# Altium schematic sheet 10 - GMAC0.SchDoc
size B; CompanyName: Microchip Technology Inc.; Organization: Microchip Technology; Address1: 2355 West Chandler Blvd.; Address2: Chandler, AZ  85224; Address4: USA; DocumentNumber: 10; SheetNumber: 10; SheetTotal: 15; SheetTitle: RGMII LAN8840
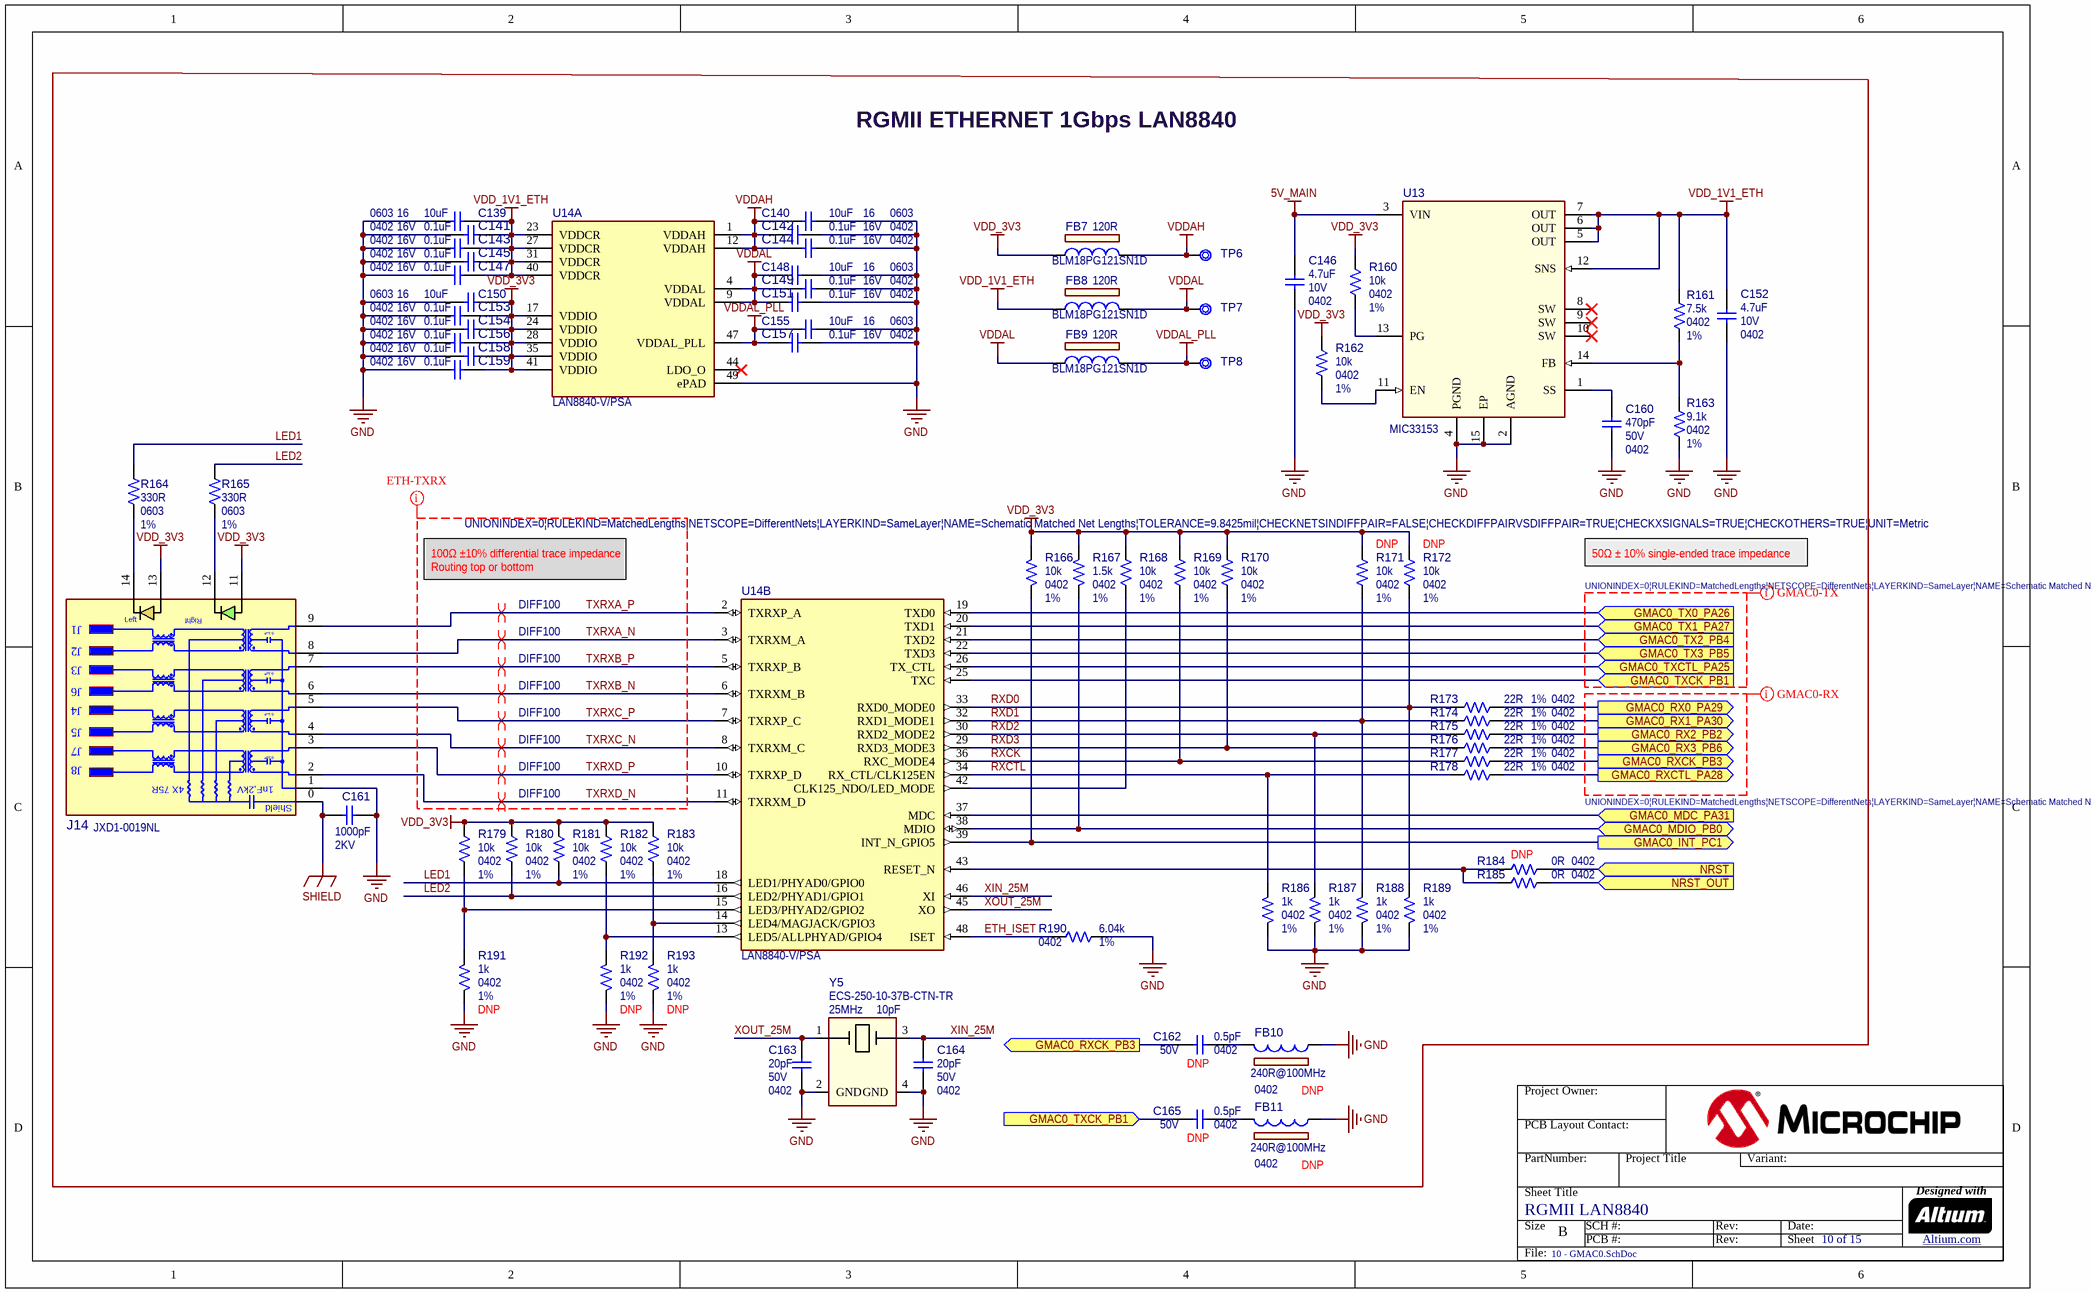
[diagram p0: 10 - GMAC0.SchDoc]

## Parts
C139  value 10uF  Voltage: 16  Package: 0603  [CAP_C_0603]  (hidden comment: Capacitor NP)
C140  value 10uF  Voltage: 16  Package: 0603  [CAP_C_0603]  (hidden comment: Capacitor NP)
C141  value 0.1uF  Voltage: 16V  Package: 0402  [CAP_C_0402]  (hidden comment: Capacitor NP)
C142  value 0.1uF  Voltage: 16V  Package: 0402  [CAP_C_0402]  (hidden comment: Capacitor NP)
C143  value 0.1uF  Voltage: 16V  Package: 0402  [CAP_C_0402]  (hidden comment: Capacitor NP)
C144  value 0.1uF  Voltage: 16V  Package: 0402  [CAP_C_0402]  (hidden comment: Capacitor NP)
C145  value 0.1uF  Voltage: 16V  Package: 0402  [CAP_C_0402]  (hidden comment: Capacitor NP)
C146  value 4.7uF  Voltage: 10V  Package: 0402  [CAP_C_0402]  (hidden comment: Capacitor NP)
C147  value 0.1uF  Voltage: 16V  Package: 0402  [CAP_C_0402]  (hidden comment: Capacitor NP)
C148  value 10uF  Voltage: 16  Package: 0603  [CAP_C_0603]  (hidden comment: Capacitor NP)
C149  value 0.1uF  Voltage: 16V  Package: 0402  [CAP_C_0402]  (hidden comment: Capacitor NP)
C150  value 10uF  Voltage: 16  Package: 0603  [CAP_C_0603]  (hidden comment: Capacitor NP)
C151  value 0.1uF  Voltage: 16V  Package: 0402  [CAP_C_0402]  (hidden comment: Capacitor NP)
C152  value 4.7uF  Voltage: 10V  Package: 0402  [CAP_C_0402]  (hidden comment: Capacitor NP)
C153  value 0.1uF  Voltage: 16V  Package: 0402  [CAP_C_0402]  (hidden comment: Capacitor NP)
C154  value 0.1uF  Voltage: 16V  Package: 0402  [CAP_C_0402]  (hidden comment: Capacitor NP)
C155  value 10uF  Voltage: 16  Package: 0603  [CAP_C_0603]  (hidden comment: Capacitor NP)
C156  value 0.1uF  Voltage: 16V  Package: 0402  [CAP_C_0402]  (hidden comment: Capacitor NP)
C157  value 0.1uF  Voltage: 16V  Package: 0402  [CAP_C_0402]  (hidden comment: Capacitor NP)
C158  value 0.1uF  Voltage: 16V  Package: 0402  [CAP_C_0402]  (hidden comment: Capacitor NP)
C159  value 0.1uF  Voltage: 16V  Package: 0402  [CAP_C_0402]  (hidden comment: Capacitor NP)
C160  value 470pF  Voltage: 50V  Package: 0402  [CAP_C_0402]  (hidden comment: Capacitor NP)
C161  value 1000pF  Voltage: 2KV  [CAP_C_1206]  (hidden comment: Capacitor NP)
C162  value 0.5pF  Voltage: 50V  Package: 0402  Populated: DNP  [CAP_C_0402]  (hidden comment: Capacitor NP)
C163  value 20pF  Voltage: 50V  Package: 0402  [CAP_C_0402]  (hidden comment: Capacitor NP)
C164  value 20pF  Voltage: 50V  Package: 0402  [CAP_C_0402]  (hidden comment: Capacitor NP)
C165  value 0.5pF  Voltage: 50V  Package: 0402  Populated: DNP  [CAP_C_0402]  (hidden comment: Capacitor NP)
FB7  value 120R  Manufacturer Part Number 1: BLM18PG121SN1D  [IND_C_0603]  (hidden comment: Ferrite Bead)
FB8  value 120R  Manufacturer Part Number 1: BLM18PG121SN1D  [IND_C_0603]  (hidden comment: Ferrite Bead)
FB9  value 120R  Manufacturer Part Number 1: BLM18PG121SN1D  [IND_C_0603]  (hidden comment: Ferrite Bead)
FB10  value 240R@100MHz  Package: 0402  Populated: DNP  [IND_C_0402]  (hidden comment: Ferrite Bead)
FB11  value 240R@100MHz  Package: 0402  Populated: DNP  [IND_C_0402]  (hidden comment: Ferrite Bead)
J14  Manufacturer Part Number 1: JXD1-0019NL  [CON_RJ-45_TH_RA_PULSE_JXD1-0019NL]  (hidden comment: CON_RJ-45_TH_RA_PULSE_JXD1-0019NL)
R160  value 10k  Package: 0402  Tolerance: 1%  [RES_C_0402]  (hidden comment: Resistor)
R161  value 7.5k  Package: 0402  Tolerance: 1%  [RES_C_0402]  (hidden comment: Resistor)
R162  value 10k  Package: 0402  Tolerance: 1%  [RES_C_0402]  (hidden comment: Resistor)
R163  value 9.1k  Package: 0402  Tolerance: 1%  [RES_C_0402]  (hidden comment: Resistor)
R164  value 330R  Package: 0603  Tolerance: 1%  [RES_C_0603]  (hidden comment: Resistor)
R165  value 330R  Package: 0603  Tolerance: 1%  [RES_C_0603]  (hidden comment: Resistor)
R166  value 10k  Package: 0402  Tolerance: 1%  [RES_C_0402]  (hidden comment: Resistor)
R167  value 1.5k  Package: 0402  Tolerance: 1%  [RES_C_0402]  (hidden comment: Resistor)
R168  value 10k  Package: 0402  Tolerance: 1%  [RES_C_0402]  (hidden comment: Resistor)
R169  value 10k  Package: 0402  Tolerance: 1%  [RES_C_0402]  (hidden comment: Resistor)
R170  value 10k  Package: 0402  Tolerance: 1%  [RES_C_0402]  (hidden comment: Resistor)
R171  value 10k  Package: 0402  Tolerance: 1%  Populated: DNP  [RES_C_0402]  (hidden comment: Resistor)
R172  value 10k  Package: 0402  Tolerance: 1%  Populated: DNP  [RES_C_0402]  (hidden comment: Resistor)
R173  value 22R  Package: 0402  Tolerance: 1%  [RES_C_0402]  (hidden comment: Resistor)
R174  value 22R  Package: 0402  Tolerance: 1%  [RES_C_0402]  (hidden comment: Resistor)
R175  value 22R  Package: 0402  Tolerance: 1%  [RES_C_0402]  (hidden comment: Resistor)
R176  value 22R  Package: 0402  Tolerance: 1%  [RES_C_0402]  (hidden comment: Resistor)
R177  value 22R  Package: 0402  Tolerance: 1%  [RES_C_0402]  (hidden comment: Resistor)
R178  value 22R  Package: 0402  Tolerance: 1%  [RES_C_0402]  (hidden comment: Resistor)
R179  value 10k  Package: 0402  Tolerance: 1%  [RES_C_0402]  (hidden comment: Resistor)
R180  value 10k  Package: 0402  Tolerance: 1%  [RES_C_0402]  (hidden comment: Resistor)
R181  value 10k  Package: 0402  Tolerance: 1%  [RES_C_0402]  (hidden comment: Resistor)
R182  value 10k  Package: 0402  Tolerance: 1%  [RES_C_0402]  (hidden comment: Resistor)
R183  value 10k  Package: 0402  Tolerance: 1%  [RES_C_0402]  (hidden comment: Resistor)
R184  value 0R  Package: 0402  Populated: DNP  [RES_C_0402]  (hidden comment: Resistor)
R185  value 0R  Package: 0402  [RES_C_0402]  (hidden comment: Resistor)
R186  value 1k  Package: 0402  Tolerance: 1%  [RES_C_0402]  (hidden comment: Resistor)
R187  value 1k  Package: 0402  Tolerance: 1%  [RES_C_0402]  (hidden comment: Resistor)
R188  value 1k  Package: 0402  Tolerance: 1%  [RES_C_0402]  (hidden comment: Resistor)
R189  value 1k  Package: 0402  Tolerance: 1%  [RES_C_0402]  (hidden comment: Resistor)
R190  value 6.04k  Package: 0402  Tolerance: 1%  [RES_C_0402]  (hidden comment: Resistor)
R191  value 1k  Package: 0402  Tolerance: 1%  Populated: DNP  [RES_C_0402]  (hidden comment: Resistor)
R192  value 1k  Package: 0402  Tolerance: 1%  Populated: DNP  [RES_C_0402]  (hidden comment: Resistor)
R193  value 1k  Package: 0402  Tolerance: 1%  Populated: DNP  [RES_C_0402]  (hidden comment: Resistor)
TP6  Test Point No BOM  [TP_1mm_SMD]  (value not drawn)  (no BOM)
TP7  Test Point No BOM  [TP_1mm_SMD]  (value not drawn)  (no BOM)
TP8  Test Point No BOM  [TP_1mm_SMD]  (value not drawn)  (no BOM)
U13  value MIC33153  [VFDFN-14_3X3.5_MIC33153]  (hidden comment: MIC33153 VFDFN-14)
U14  value LAN8840-V/PSA  [QFN-48_7x7_EP5.1x5.1]  (hidden comment: LAN8840_QFN-48)  (parts A,B of 2)
Y5  value 25MHz  Load Capacitance: 10pF  Manufacturer Part Number 1: ECS-250-10-37B-CTN-TR  [CRYSTAL_L2.0W1.6H0.5_FA-128]  (hidden comment: Crystal 4 Pins)

## Blocks framed on the sheet
RGMII ETHERNET 1Gbps LAN8840: C139-C165 FB7-FB11 J14 R160-R193 TP6-TP8 U13 U14 Y5

## Ports
GMAC0_INT_PC1 (out), GMAC0_MDC_PA31 (in), GMAC0_MDIO_PB0 (bidir), GMAC0_RX0_PA29 (out), GMAC0_RX1_PA30 (out), GMAC0_RX2_PB2 (out), GMAC0_RX3_PB6 (out), GMAC0_RXCK_PB3 (out), GMAC0_RXCTL_PA28 (out), GMAC0_TX0_PA26 (in), GMAC0_TX1_PA27 (in), GMAC0_TX2_PB4 (in), GMAC0_TX3_PB5 (in), GMAC0_TXCK_PB1 (in), GMAC0_TXCTL_PA25 (in), NRST (in), NRST_OUT (in)

## Nets
5V_MAIN: C146.2 U13.3(VIN)
GND: C139.2 C140.2 C141.2 C142.2 C143.2 C144.2 C145.2 C146.1 C147.2 C148.2 C149.2 C150.2 C151.2 C152.1 C153.2 C154.2 C155.2 C156.2 C157.2 C158.2 C159.2 C160.1 C161.1 C163.1 C164.1 FB10.1 FB11.1 J14.1 R163.1 R186.1 R187.1 R188.1 R189.1 R190.2 R191.1 R192.1 R193.1 U13.2(AGND) U13.4(PGND) U13.15(EP) U14.49(ePAD) Y5.2(GND) Y5.4(GND)
SHIELD: C161.2 J14.0
VDD_1V1_ETH: C139.1 C141.1 C143.1 C145.1 C147.1 C152.2 FB8.1 R161.2 U13.5(OUT) U13.6(OUT) U13.7(OUT) U13.12(SNS) U14.23(VDDCR) U14.27(VDDCR) U14.31(VDDCR) U14.40(VDDCR)
VDD_3V3: C150.1 C153.1 C154.1 C156.1 C158.1 C159.1 FB7.1 J14.11 J14.13 R160.2 R162.2 R166.2 R167.2 R168.2 R169.2 R170.2 R171.2 R172.2 R179.2 R180.2 R181.2 R182.2 R183.2 U14.17(VDDIO) U14.24(VDDIO) U14.28(VDDIO) U14.35(VDDIO) U14.41(VDDIO)
VDDAH: C140.1 C142.1 C144.1 FB7.2 TP6.1 U14.1(VDDAH) U14.12(VDDAH)
VDDAL: C148.1 C149.1 C151.1 FB8.2 FB9.1 TP7.1 U14.4(VDDAL) U14.9(VDDAL)
VDDAL_PLL: C155.1 C157.1 FB9.2 TP8.1 U14.47(VDDAL_PLL)
ETH_ISET: R190.1 U14.48(ISET)
GMAC0_INT_PC1: R166.1 U14.39(INT_N_GPIO5) ; port GMAC0_INT_PC1
GMAC0_MDC_PA31: U14.37(MDC) ; port GMAC0_MDC_PA31
GMAC0_MDIO_PB0: R167.1 U14.38(MDIO) ; port GMAC0_MDIO_PB0
GMAC0_RX0_PA29: R173.2 ; port GMAC0_RX0_PA29
GMAC0_RX1_PA30: R174.2 ; port GMAC0_RX1_PA30
GMAC0_RX2_PB2: R175.2 ; port GMAC0_RX2_PB2
GMAC0_RX3_PB6: R176.2 ; port GMAC0_RX3_PB6
GMAC0_RXCK_PB3: C162.2 R177.2 ; port GMAC0_RXCK_PB3
GMAC0_RXCTL_PA28: R178.2 ; port GMAC0_RXCTL_PA28
GMAC0_TX0_PA26: U14.19(TXD0) ; port GMAC0_TX0_PA26
GMAC0_TX1_PA27: U14.20(TXD1) ; port GMAC0_TX1_PA27
GMAC0_TX2_PB4: U14.21(TXD2) ; port GMAC0_TX2_PB4
GMAC0_TX3_PB5: U14.22(TXD3) ; port GMAC0_TX3_PB5
GMAC0_TXCK_PB1: C165.2 U14.25(TXC) ; port GMAC0_TXCK_PB1
GMAC0_TXCTL_PA25: U14.26(TX_CTL) ; port GMAC0_TXCTL_PA25
LED1: R164.2 R181.1 U14.18(LED1/PHYAD0/GPIO0)
LED2: R165.2 R180.1 U14.16(LED2/PHYAD1/GPIO1)
NRST: R184.2 ; port NRST
NRST_OUT: R185.2 ; port NRST_OUT
RXCK: R169.1 R177.1 U14.36(RXC_MODE4)
RXCTL: R178.1 R186.2 U14.34(RX_CTL/CLK125EN)
RXD0: R172.1 R173.1 R189.2 U14.33(RXD0_MODE0)
RXD1: R171.1 R174.1 R188.2 U14.32(RXD1_MODE1)
RXD2: R175.1 R187.2 U14.30(RXD2_MODE2)
RXD3: R170.1 R176.1 U14.29(RXD3_MODE3)
TXRXA_N: J14.8 U14.3(TXRXM_A)
TXRXA_P: J14.9 U14.2(TXRXP_A)
TXRXB_N: J14.6 U14.6(TXRXM_B)
TXRXB_P: J14.7 U14.5(TXRXP_B)
TXRXC_N: J14.4 U14.8(TXRXM_C)
TXRXC_P: J14.5 U14.7(TXRXP_C)
TXRXD_N: J14.2 U14.11(TXRXM_D)
TXRXD_P: J14.3 U14.10(TXRXP_D)
XIN_25M: C164.2 U14.46(XI) Y5.3(Osc2)
XOUT_25M: C163.2 U14.45(XO) Y5.1(Osc1)
NetC160_2: C160.2 U13.1(SS)
NetC162_1: C162.1 FB10.2
NetC165_1: C165.1 FB11.2
NetJ14_12: J14.12 R165.1
NetJ14_14: J14.14 R164.1
NetR160_1: R160.1 U13.13(PG)
NetR161_1: R161.1 R163.2 U13.14(FB)
NetR162_1: R162.1 U13.11(EN)
NetR168_1: R168.1 U14.42(CLK125_NDO/LED_MODE)
NetR179_1: R179.1 R191.2 U14.15(LED3/PHYAD2/GPIO2)
NetR182_1: R182.1 R192.2 U14.13(LED5/ALLPHYAD/GPIO4)
NetR183_1: R183.1 R193.2 U14.14(LED4/MAGJACK/GPIO3)
NetR184_1: R184.1 R185.1 U14.43(RESET_N)

Not connected (* = marked no-connect by the designer): U13 8(SW)* 9(SW)* 10(SW)*; U14 44(LDO_O)*

## Layout directives
differential pair; differential pair class DIFF100; net class DIFF100; rule Matched Net Lengths [Tolerance = 4mil]: TXRXA_N, TXRXA_P, TXRXB_N, TXRXB_P, TXRXC_N, TXRXC_P, TXRXD_N, TXRXD_P
rule Matched Net Lengths [Tolerance = 0.25mm]; net class ETH-DIFF: TXRXA_N, TXRXA_P, TXRXB_N, TXRXB_P, TXRXC_N, TXRXC_P, TXRXD_N, TXRXD_P
rule Matched Net Lengths [Tolerance = 0.25mm]; net class GMAC0-TX: (no net found under the mark)
rule Matched Net Lengths [Tolerance = 0.25mm]; net class GMAC0-RX: (no net found under the mark)

## Notes on the sheet
- 50Ω ± 10% single-ended trace impedance
- 100Ω ±10% differential trace impedance
  Routing top or bottom
- Project Owner:
- PCB Layout Contact:
- PartNumber:
- Project Title
- Variant:
- Sheet Title
- Size
- B
- SCH #:
- PCB #:
- Rev:
- Date:
- Sheet
- Designed with
- Altium.com <http://go.altium.com/MicrochipLandingPage_Evaluation.html>
- File:
- (in symbol CON2857) Right; J1; Left; 0.1uF; J2; J3; J6; J4; J5; J7; J8; 4X 75R; 1nF,2kV; Shield

## Library data of the parts
C139 C140 C148 C150 C155 = CAP2397: Manufacturer 1: Murata; Manufacturer Part Number 1: GRT188R61C106KE13D; Description_: CAP CER 10uF 16V 10% X5R SMD 0603 AEC-Q200; Dev Tools Status: Production; Tolerance: 10%; Type: Ceramic; Owner: Sam Charles; Populated: YES; Temperature Coefficient: X5R; Restricted Sourcing: No; MCHP-ID: CAP2397; Revision: 1; Symbol: Capacitor NP; Status: MCL Design; ComponentLink1Description: SVN Datasheet; ComponentLink2Description: Local Datasheet; ComponentLink3URL: C:\ALTIUM_WORK\00001_MCHP-CDB\Library\LibraryRefs\Capacitor NP.SchLib; ComponentLink3Description: Open Symbol; ComponentLink4URL: C:\ALTIUM_WORK\00001_MCHP-CDB\Library\Footprints\CAP_C_0603.PcbLib; ComponentLink4Description: Open Footprint; ComponentLink5Description: Open Footprint 2; ComponentLink6Description: Open Footprint 3; ComponentLink7Description: Open Footprint 4; Operating Temperature: -55°C ~ 85°C; Category: Capacitor; Supplier 1: Digi-Key; Supplier Part Number 1: 490-12317-1-ND; Quantity Override: 1; ComponentLink1URL: https://chn-vm-apps.microchip.com/mchprepo/parts/Datasheets/GRT188R61C106KE13-01.pdf; ComponentLink2URL: C:\ALTIUM_WORK\00001_MCHP-CDB\Datasheets\GRT188R61C106KE13-01.pdf
C141-C145 C147 C149 C151 C153 C154 C156-C159 = CAP1033: Manufacturer 1: Hottech; Manufacturer Part Number 1: C1005B104K160NT; Description_: CAP CER 0.1uF 16V 10% X7R SMD 0402; Dev Tools Status: Production; Tolerance: 10%; Owner: Sompoch Loboonlert; Populated: Yes; Temperature Coefficient: X7R; Type: Ceramic; Restricted Sourcing: No; MCHP-ID: CAP1033; Revision: 10; Symbol: Capacitor NP; Status: MCL Design; ComponentLink1URL: https://chn-vm-apps.microchip.com/mchprepo/parts/Datasheets/L0005E.pdf; ComponentLink1Description: SVN Datasheet; ComponentLink2URL: C:\ALTIUM_WORK\00001_MCHP-CDB\Datasheets\L0005E.pdf; ComponentLink2Description: Local Datasheet; ComponentLink3URL: C:\ALTIUM_WORK\00001_MCHP-CDB\Library\LibraryRefs\Capacitor NP.SchLib; ComponentLink3Description: Open Symbol; ComponentLink4URL: C:\ALTIUM_WORK\00001_MCHP-CDB\Library\Footprints\CAP_C_0402.PcbLib; ComponentLink4Description: Open Footprint; ComponentLink5Description: Open Footprint 2; ComponentLink6Description: Open Footprint 3; ComponentLink7Description: Open Footprint 4; Operating Temperature: -55C to +125C; Category: Capacitor; Supplier 1: Hottech; Supplier Part Number 1: C1005B104K160NT; Quantity Override: 1; Manufacturer 2: KEMET; Manufacturer Part Number 2: C0402C104K4RAC7867; Manufacturer 3: Samsung Electro-Mechanics; Manufacturer Part Number 3: CL05B104KO5NNNC; Supplier 2: Digi-Key; Supplier Part Number 2: 399-C0402C104K4RAC7867TR-ND; Supplier 3: Digi-Key; Supplier Part Number 3: 1276-1001-1-ND; Manufacturer 4: Würth Elektronik; Manufacturer Part Number 4: 885012205037; Manufacturer 5: Samsung Electro-Mechanics; Manufacturer Part Number 5: CL05B104KO5NNND; Manufacturer 6: Samsung Electro-Mechanics; Manufacturer Part Number 6: CL05B104KO5NNNO; Manufacturer 7: Yageo; Manufacturer Part Number 7: CC0402KRX7R7BB104; Supplier 4: Digi-Key; Supplier Part Number 4: 732-7532-1-ND; Supplier 5: Mouser; Supplier Part Number 5: 187-CL05B104KO5NNND; Supplier 6: Samsung Electro-Mechanics; Supplier Part Number 6: CL05B104KO5NNNO; Supplier 7: Yageo; Supplier Part Number 7: CC0402KRX7R7BB104
C146 C152 = CAP1684: Capacitor; Manufacturer 1: TDK Corporation; Manufacturer Part Number 1: C1005X5R1A475K050BC; Description_: CAP CER 4.7uF 10V 10% X5R SMD 0402; Dev Tools Status: Production; Tolerance: 10%; Temperature Coeffcient: X5R; Type: Ceramic; Owner: Jesus Aviles; Populated: YES; MCHP-ID: CAP1684; Revision: 1; Symbol: Capacitor NP; Status: MCL Design; ComponentLink1Description: SVN Datasheet; ComponentLink2Description: Local Datasheet; ComponentLink3URL: C:\ALTIUM_WORK\00001_MCHP-CDB\Library\LibraryRefs\Capacitor NP.SchLib; ComponentLink3Description: Open Symbol; ComponentLink4URL: C:\ALTIUM_WORK\00001_MCHP-CDB\Library\Footprints\CAP_C_0402.PcbLib; ComponentLink4Description: Open Footprint; ComponentLink5Description: Open Footprint 2; ComponentLink6Description: Open Footprint 3; ComponentLink7Description: Open Footprint 4; Operating Temperature: -55C to 85C; Category: Capacitor; Supplier 1: Digi-Key; Supplier Part Number 1: 445-13820-1-ND; Quantity Override: 1
C160 = CAP1382: Manufacturer 1: Murata; Manufacturer Part Number 1: GRM1555C1H471JA01D; Description_: CAP CER 470pF 50V 5% NP0 SMD 0402; Dev Tools Status: Production; Tolerance: 5%; Temperature Coefficient: NP0; Type: Ceramic; Owner: Duane Burt; Populated: YES; Restricted Sourcing: No; MCHP-ID: CAP1382; Revision: 3; Symbol: Capacitor NP; Status: MCL Design; ComponentLink1URL: https://chn-vm-apps.microchip.com/mchprepo/parts/Datasheets/c02e.pdf; ComponentLink1Description: SVN Datasheet; ComponentLink2URL: C:\ALTIUM_WORK\00001_MCHP-CDB\Datasheets\c02e.pdf; ComponentLink2Description: Local Datasheet; ComponentLink3URL: C:\ALTIUM_WORK\00001_MCHP-CDB\Library\LibraryRefs\Capacitor NP.SchLib; ComponentLink3Description: Open Symbol; ComponentLink4URL: C:\ALTIUM_WORK\00001_MCHP-CDB\Library\Footprints\CAP_C_0402.PcbLib; ComponentLink4Description: Open Footprint; ComponentLink5Description: Open Footprint 2; ComponentLink6Description: Open Footprint 3; ComponentLink7Description: Open Footprint 4; Operating Temperature: -55C to +125C; Category: Capacitor; Manufacturer 2: Yageo; Manufacturer Part Number 2: CC0402JRNPO9BN471; Supplier 1: Digi-Key; Supplier Part Number 1: 490-1297-1-ND; Supplier 2: Yageo; Supplier Part Number 2: CC0402JRNPO9BN471; Quantity Override: 1
C161 = CAP1428: Manufacturer 1: D3_Johanson Dielectrics Inc; Manufacturer Part Number 1: 202R18W102KV4E; Description_: CAP CER 1000pF 2KV 10% X7R SMD 1206; Dev Tools Status: Production; Type: Ceramic; Owner: Jamus Griego; Populated: YES; Restricted Sourcing: No; MCHP-ID: CAP1428; Revision: 5; Symbol: Capacitor NP; Status: MCL Design; ComponentLink1URL: https://chn-vm-apps.microchip.com/mchprepo/parts/Datasheets/JDI-Product-Catalog.pdf; ComponentLink1Description: SVN Datasheet; ComponentLink2URL: C:\ALTIUM_WORK\00001_MCHP-CDB\Datasheets\JDI-Product-Catalog.pdf; ComponentLink2Description: Local Datasheet; ComponentLink3URL: C:\ALTIUM_WORK\00001_MCHP-CDB\Library\LibraryRefs\Capacitor NP.SchLib; ComponentLink3Description: Open Symbol; ComponentLink4URL: C:\ALTIUM_WORK\00001_MCHP-CDB\Library\Footprints\CAP_C_1206.PcbLib; ComponentLink4Description: Open Footprint; ComponentLink5Description: Open Footprint 2; ComponentLink6Description: Open Footprint 3; ComponentLink7Description: Open Footprint 4; Category: Capacitor; Manufacturer 2: KYOCERA AVX; Manufacturer Part Number 2: 1206GC102KAT2A; Manufacturer 3: Yageo; Manufacturer Part Number 3: CC1206KKX7RDBB102; Supplier 1: Digi-Key; Supplier Part Number 1: 709-1036-1-ND; Supplier 2: Digi-Key; Supplier Part Number 2: 478-7023-1-ND; Supplier 3: Yageo; Supplier Part Number 3: CC1206KKX7RDBB102; Quantity Override: 1
C162 C165 = CAP0274: Manufacturer 1: KEMET; Manufacturer Part Number 1: C0402C508C5GACTU; Description_: CAP CER 0.5pF 50V 0.25pF NP0 SMD 0402; Dev Tools Status: Production; Tolerance: 0.25pF; Temperature Coefficient: NP0; Type: Ceramic; Restricted Sourcing: No; MCHP-ID: CAP0274; Revision: 2; Symbol: Capacitor NP; Status: MCL Design; ComponentLink1URL: https://chn-vm-apps.microchip.com/mchprepo/parts/Datasheets/MLCC_ordering_code.pdf; ComponentLink1Description: SVN Datasheet; ComponentLink2URL: C:\ALTIUM_WORK\00001_MCHP-CDB\Datasheets\MLCC_ordering_code.pdf; ComponentLink2Description: Local Datasheet; ComponentLink3URL: C:\ALTIUM_WORK\00001_MCHP-CDB\Library\LibraryRefs\Capacitor NP.SchLib; ComponentLink3Description: Open Symbol; ComponentLink4URL: C:\ALTIUM_WORK\00001_MCHP-CDB\Library\Footprints\CAP_C_0402.PcbLib; ComponentLink4Description: Open Footprint; ComponentLink5Description: Open Footprint 2; ComponentLink6Description: Open Footprint 3; ComponentLink7Description: Open Footprint 4; Operating Temperature: -55C to +125C; Category: Capacitor; Manufacturer 2: KYOCERA AVX; Manufacturer Part Number 2: 04025A0R5CAT2A; Manufacturer 3: Yageo; Manufacturer Part Number 3: CC0402CRNPO9BNR50; Supplier 1: Digi-Key; Supplier Part Number 1: 399-1000-2-ND; Supplier 2: Digi-Key; Supplier Part Number 2: 478-1057-2-ND; Supplier 3: Digi-Key; Supplier Part Number 3: 311-1001-2-ND; Quantity Override: 1
C163 C164 = CAP0364: Manufacturer 1: Yageo; Manufacturer Part Number 1: CC0402JRNPO9BN200; Description_: CAP CER 20pF 50V 5% C0G SMD 0402; Dev Tools Status: Production; Tolerance: 5%; Populated: YES; Temperature Coefficient: C0G; Type: Ceramic; Restricted Sourcing: No; MCHP-ID: CAP0364; Revision: 2; Symbol: Capacitor NP; Status: MCL Design; ComponentLink1URL: https://chn-vm-apps.microchip.com/mchprepo/parts/Datasheets/c02e.pdf; ComponentLink1Description: SVN Datasheet; ComponentLink2URL: C:\ALTIUM_WORK\00001_MCHP-CDB\Datasheets\c02e.pdf; ComponentLink2Description: Local Datasheet; ComponentLink3URL: C:\ALTIUM_WORK\00001_MCHP-CDB\Library\LibraryRefs\Capacitor NP.SchLib; ComponentLink3Description: Open Symbol; ComponentLink4URL: C:\ALTIUM_WORK\00001_MCHP-CDB\Library\Footprints\CAP_C_0402.PcbLib; ComponentLink4Description: Open Footprint; ComponentLink5Description: Open Footprint 2; ComponentLink6Description: Open Footprint 3; ComponentLink7Description: Open Footprint 4; Operating Temperature: -55C to +125C; Category: Capacitor; Supplier 1: Digi-Key; Supplier Part Number 1: 311-1417-1-ND; Quantity Override: 1
FB7-FB9 = IND1009: Manufacturer 1: Murata; Description_: FERRITE BEAD 120 OHM 0603 1LN; Dev Tools Status: Production; Owner: Petnarong Chaijaroong; DCR: 0.05R; Populated: Yes; Saturation Current: 12A; Restricted Sourcing: No; MCHP-ID: IND1009; Revision: 0; Symbol: Ferrite Bead; Status: MCL Design; ComponentLink1URL: https://chn-vm-apps.microchip.com/mchprepo/parts/Datasheets/L0110S0100BLM18P.pdf; ComponentLink1Description: SVN Datasheet; ComponentLink2URL: C:\ALTIUM_WORK\00001_MCHP-CDB\Datasheets\L0110S0100BLM18P.pdf; ComponentLink2Description: Local Datasheet; ComponentLink3URL: C:\ALTIUM_WORK\00001_MCHP-CDB\Library\LibraryRefs\Ferrite Bead.SchLib; ComponentLink3Description: Open Symbol; ComponentLink4URL: C:\ALTIUM_WORK\00001_MCHP-CDB\Library\Footprints\IND_C_0603.PcbLib; ComponentLink4Description: Open Footprint; ComponentLink5Description: Open Footprint 2; ComponentLink6Description: Open Footprint 3; ComponentLink7Description: Open Footprint 4; Operating Temperature: -55C to +125C; Package: 0603; Type: Ferrite Bead; Category: Inductor; Supplier 1: digikey; Supplier Part Number 1: 490-1037-1-ND; Quantity Override: 1
FB10 FB11 = FB1020: Manufacturer 1: TDK Corporation; Manufacturer Part Number 1: MMZ1005Y241CT000; MCHP-ID: FB1020; Description_: FERRITE 240R @100MHz 300mA SMD 0402; Dev Tools Status: Design; Owner: Joerg Buehrer; DCR: 260 mR; Revision: 1; Symbol: Ferrite Bead; Status: MCL Design; ComponentLink1URL: https://chn-vm-apps.microchip.com/mchprepo/parts/Datasheets/beads_commercial_signal_mmz1005_en.pdf; ComponentLink1Description: SVN Datasheet; ComponentLink2URL: C:\ALTIUM_WORK\00001_MCHP-CDB\Datasheets\beads_commercial_signal_mmz1005_en.pdf; ComponentLink2Description: Local Datasheet; ComponentLink3URL: C:\ALTIUM_WORK\00001_MCHP-CDB\Library\LibraryRefs\Ferrite Bead.SchLib; ComponentLink3Description: Open Symbol; ComponentLink4URL: C:\ALTIUM_WORK\00001_MCHP-CDB\Library\Footprints\IND_C_0402.PcbLib; ComponentLink4Description: Open Footprint; ComponentLink5Description: Open Footprint 2; ComponentLink6Description: Open Footprint 3; ComponentLink7Description: Open Footprint 4; Operating Temperature: -55°C ~ 125°C; Type: Ferrite Bead; Category: Inductor; Manufacturer 2: TDK Corporation; Manufacturer Part Number 2: MMZ1005Y241CT000; Supplier 1: Digi-Key; Supplier Part Number 1: 445-2153-1-ND; Supplier 2: Mouser; Supplier Part Number 2: 810-MMZ1005Y241CT000; Quantity Override: 1
J14 = CON2857: Manufacturer 1: Pulse Electronics; Description_: CON MODULAR JACK RJ45 10/100/1000 MAGNETICS 2xLEDs SHIELD TH R/A; Dev Tools Status: Design; Owner: Ciprian Abramov; Populated: YES; Restricted Sourcing: No; MCHP-ID: CON2857; Value: JXD1-0019NL; Revision: 2; Symbol: CON_RJ-45_TH_RA_PULSE_JXD1-0019NL; Status: MCL Design; ComponentLink1URL: https://chn-vm-apps.microchip.com/mchprepo/parts/Datasheets/datasheet_jxd1-0019nl_1608369601.pdf; ComponentLink1Description: SVN Datasheet; ComponentLink2URL: C:\ALTIUM_WORK\00001_MCHP-CDB\Datasheets\datasheet_jxd1-0019nl_1608369601.pdf; ComponentLink2Description: Local Datasheet; ComponentLink3URL: C:\ALTIUM_WORK\00001_MCHP-CDB\Library\LibraryRefs\CON_RJ-45_TH_RA_PULSE_JXD1-0019NL.SchLib; ComponentLink3Description: Open Symbol; ComponentLink4URL: C:\ALTIUM_WORK\00001_MCHP-CDB\Library\Footprints\CON_RJ-45_TH_RA_PULSE_JXD1-0019NL.PcbLib; ComponentLink4Description: Open Footprint; ComponentLink5Description: Open Footprint 2; ComponentLink6Description: Open Footprint 3; ComponentLink7Description: Open Footprint 4; Type: Modular; Category: Connector; Supplier 1: Digi-Key; Supplier Part Number 1: 553-JXD1-0019NL-ND; Quantity Override: 1; Operating Temperature: -40C to +85C; Assembly Type: TH
R160 R162 R166 R168-R170 R179-R183 = RSMT1019: Manufacturer 1: Panasonic; Manufacturer Part Number 1: ERJ-2RKF1002X; Description_: RES TKF 10k 1% 1/10W SMD 0402; Dev Tools Status: Production; Voltage: 50V; Power: 1/10W; Owner: Brent Lanphear; Populated: Yes; Temperature Coefficient: 100ppm/C; MCHP-ID: RSMT1019; Revision: 2; Symbol: Resistor; Status: MCL Design; ComponentLink1URL: https://chn-vm-apps.microchip.com/mchprepo/parts/Datasheets/AOA0000CE2.pdf; ComponentLink1Description: SVN Datasheet; ComponentLink2URL: C:\ALTIUM_WORK\00001_MCHP-CDB\Datasheets\AOA0000CE2.pdf; ComponentLink2Description: Local Datasheet; ComponentLink3URL: C:\ALTIUM_WORK\00001_MCHP-CDB\Library\LibraryRefs\Resistor.SchLib; ComponentLink3Description: Open Symbol; ComponentLink4URL: C:\ALTIUM_WORK\00001_MCHP-CDB\Library\Footprints\RES_C_0402.PcbLib; ComponentLink4Description: Open Footprint; ComponentLink5Description: Open Footprint 2; ComponentLink6Description: Open Footprint 3; ComponentLink7Description: Open Footprint 4; Operating Temperature: -55C to +155C; Category: Resistor; Type: RES SMD; Composition: TKF; Supplier 1: Digi-Key; Supplier Part Number 1: P10.0KLCT-ND; Quantity Override: 1
R161 = RES1458: Manufacturer 1: KOA Speer; Manufacturer Part Number 1: RK73H1ETTP7501F; Description_: RES TKF 7.5k 1% 1/16W SMD 0402; Dev Tools Status: Production; Temperature Coefficient: 100ppm/C; Circuit Type: Isolated; Power: 1/16W; Owner: Stephen Humberd; Populated: YES; MCHP-ID: RES1458; Revision: 1; Symbol: Resistor; Status: MCL Design; ComponentLink1URL: https://chn-vm-apps.microchip.com/mchprepo/parts/Datasheets/RK73H.pdf; ComponentLink1Description: SVN Datasheet; ComponentLink2URL: C:\ALTIUM_WORK\00001_MCHP-CDB\Datasheets\RK73H.pdf; ComponentLink2Description: Local Datasheet; ComponentLink3URL: C:\ALTIUM_WORK\00001_MCHP-CDB\Library\LibraryRefs\Resistor.SchLib; ComponentLink3Description: Open Symbol; ComponentLink4URL: C:\ALTIUM_WORK\00001_MCHP-CDB\Library\Footprints\RES_C_0402.PcbLib; ComponentLink4Description: Open Footprint; ComponentLink5Description: Open Footprint 2; ComponentLink6Description: Open Footprint 3; ComponentLink7Description: Open Footprint 4; Operating Temperature: -55C to +155C; Category: Resistor; Type: RES SMD; Composition: TF; Supplier 1: Mouser; Supplier Part Number 1: 660-RK73H1ETTP7501F; Quantity Override: 1
R163 = RES1513: Manufacturer 1: Panasonic Electronic Components; Manufacturer Part Number 1: ERJ-2RKF9101X; Description_: RES TKF 9.1k 1% 1/10W SMD 0402; Dev Tools Status: Production; Voltage: 50V; Temperature Coefficient: 100ppm/C; Power: 1/10W; Populated: YES; MCHP-ID: RES1513; Revision: 1; Symbol: RESISTOR; Status: MCL Design; ComponentLink1URL: https://chn-vm-apps.microchip.com/mchprepo/parts/Datasheets/AOA0000CE2.pdf; ComponentLink1Description: SVN Datasheet; ComponentLink2URL: C:\ALTIUM_WORK\00001_MCHP-CDB\Datasheets\AOA0000CE2.pdf; ComponentLink2Description: Local Datasheet; ComponentLink3URL: C:\ALTIUM_WORK\00001_MCHP-CDB\Library\LibraryRefs\RESISTOR.SchLib; ComponentLink3Description: Open Symbol; ComponentLink4URL: C:\ALTIUM_WORK\00001_MCHP-CDB\Library\Footprints\RES_C_0402.PcbLib; ComponentLink4Description: Open Footprint; ComponentLink5Description: Open Footprint 2; ComponentLink6Description: Open Footprint 3; ComponentLink7Description: Open Footprint 4; Operating Temperature: -55C to +155C; Category: Resistor; Type: RES SMD; Composition: TKF; Supplier 1: Digi-Key; Supplier Part Number 1: P9.10KLCT-ND; Quantity Override: 1
R164 R165 = RSMT0626: Manufacturer 1: Panasonic; Manufacturer Part Number 1: ERJ-3EKF3300V; Description_: RES TKF 330R 1% 1/10W SMD 0603; Dev Tools Status: Production; Voltage: 75V; Temperature Coefficient: 100ppm/C; Power: 1/10W; Populated: Yes; MCHP-ID: RSMT0626; Revision: 2; Symbol: Resistor; Status: MCL Design; ComponentLink1URL: https://chn-vm-apps.microchip.com/mchprepo/parts/Datasheets/AOA0000CE2.pdf; ComponentLink1Description: SVN Datasheet; ComponentLink2URL: C:\ALTIUM_WORK\00001_MCHP-CDB\Datasheets\AOA0000CE2.pdf; ComponentLink2Description: Local Datasheet; ComponentLink3URL: C:\ALTIUM_WORK\00001_MCHP-CDB\Library\LibraryRefs\Resistor.SchLib; ComponentLink3Description: Open Symbol; ComponentLink4URL: C:\ALTIUM_WORK\00001_MCHP-CDB\Library\Footprints\RES_C_0603.PcbLib; ComponentLink4Description: Open Footprint; ComponentLink5Description: Open Footprint 2; ComponentLink6Description: Open Footprint 3; ComponentLink7Description: Open Footprint 4; Operating Temperature: -55C to +155C; Category: Resistor; Type: RES SMD; Composition: TKF; Manufacturer 2: Stackpole Electronics Inc; Manufacturer Part Number 2: RMCF0603FT330R; Supplier 1: Digi-Key; Supplier Part Number 1: P330HCT-ND; Supplier 2: Digi-Key; Supplier Part Number 2: RMCF0603FT330RCT-ND; Quantity Override: 1
R167 = RES2289: Manufacturer 1: Panasonic; Manufacturer Part Number 1: ERJ-2RKF1501X; Description_: RES TKF 1.5k 1% 1/10W SMD 0402 AEC-Q200; Dev Tools Status: Production; Power: 1/10W; Owner: Gabor Bihari; Populated: YES; Temperature Coefficient: 100ppm/C; Restricted Sourcing: No; MCHP-ID: RES2289; Revision: 1; Symbol: Resistor; Status: MCL Design; ComponentLink1URL: https://chn-vm-apps.microchip.com/mchprepo/parts/Datasheets/AOA0000C304.pdf; ComponentLink1Description: SVN Datasheet; ComponentLink2URL: C:\ALTIUM_WORK\00001_MCHP-CDB\Datasheets\AOA0000C304.pdf; ComponentLink2Description: Local Datasheet; ComponentLink3URL: C:\ALTIUM_WORK\00001_MCHP-CDB\Library\LibraryRefs\Resistor.SchLib; ComponentLink3Description: Open Symbol; ComponentLink4URL: C:\ALTIUM_WORK\00001_MCHP-CDB\Library\Footprints\RES_C_0402.PcbLib; ComponentLink4Description: Open Footprint; ComponentLink5Description: Open Footprint 2; ComponentLink6Description: Open Footprint 3; ComponentLink7Description: Open Footprint 4; Operating Temperature: -55°C - 155°C; Category: Resistor; Type: RES SMD; Composition: TKF; Supplier 1: Digi-Key; Supplier Part Number 1: P1.50KLCT-ND; Quantity Override: 1
R171 R172 = RSMT1019: Manufacturer 1: Panasonic; Manufacturer Part Number 1: ERJ-2RKF1002X; Description_: RES TKF 10k 1% 1/10W SMD 0402; Dev Tools Status: Production; Voltage: 50V; Power: 1/10W; Owner: Brent Lanphear; Temperature Coefficient: 100ppm/C; MCHP-ID: RSMT1019; Revision: 2; Symbol: Resistor; Status: MCL Design; ComponentLink1URL: https://chn-vm-apps.microchip.com/mchprepo/parts/Datasheets/AOA0000CE2.pdf; ComponentLink1Description: SVN Datasheet; ComponentLink2URL: C:\ALTIUM_WORK\00001_MCHP-CDB\Datasheets\AOA0000CE2.pdf; ComponentLink2Description: Local Datasheet; ComponentLink3URL: C:\ALTIUM_WORK\00001_MCHP-CDB\Library\LibraryRefs\Resistor.SchLib; ComponentLink3Description: Open Symbol; ComponentLink4URL: C:\ALTIUM_WORK\00001_MCHP-CDB\Library\Footprints\RES_C_0402.PcbLib; ComponentLink4Description: Open Footprint; ComponentLink5Description: Open Footprint 2; ComponentLink6Description: Open Footprint 3; ComponentLink7Description: Open Footprint 4; Operating Temperature: -55C to +155C; Category: Resistor; Type: RES SMD; Composition: TKF; Supplier 1: Digi-Key; Supplier Part Number 1: P10.0KLCT-ND; Quantity Override: 1
R173-R178 = RES1474: Manufacturer 1: Panasonic Electronic Components; Manufacturer Part Number 1: ERJ-2RKF22R0X; Description_: RES TKF 22R 1% 1/20W SMD 0402; Dev Tools Status: Production; Power: 1/10W; Owner: Mike Ragsdale; Populated: YES; Temperature Coefficient: 100ppm/C; Circuit Type: Isolated; MCHP-ID: RES1474; Revision: 2; Symbol: Resistor; Status: MCL Design; ComponentLink1Description: SVN Datasheet; ComponentLink2Description: Local Datasheet; ComponentLink3URL: C:\ALTIUM_WORK\00001_MCHP-CDB\Library\LibraryRefs\Resistor.SchLib; ComponentLink3Description: Open Symbol; ComponentLink4URL: C:\ALTIUM_WORK\00001_MCHP-CDB\Library\Footprints\RES_C_0402.PcbLib; ComponentLink4Description: Open Footprint; ComponentLink5Description: Open Footprint 2; ComponentLink6Description: Open Footprint 3; ComponentLink7Description: Open Footprint 4; Operating Temperature: -55C to +155C; Category: Resistor; Type: RES SMD; Composition: TKF; Supplier 1: Digi-Key; Supplier Part Number 1: P22.0LCT-ND; Quantity Override: 1
R184 = RSMT1040: Manufacturer 1: Yageo; Manufacturer Part Number 1: RC0402JR-070RL; Description_: RES TKF 0R 1/16W SMD 0402; Dev Tools Status: Production; Power: 1/16W; Owner: Sompoch Loboonlert; MCHP-ID: RSMT1040; Revision: 3; Symbol: Resistor; Status: MCL Design; ComponentLink1Description: SVN Datasheet; ComponentLink2Description: Local Datasheet; ComponentLink3URL: C:\ALTIUM_WORK\00001_MCHP-CDB\Library\LibraryRefs\Resistor.SchLib; ComponentLink3Description: Open Symbol; ComponentLink4URL: C:\ALTIUM_WORK\00001_MCHP-CDB\Library\Footprints\RES_C_0402.PcbLib; ComponentLink4Description: Open Footprint; ComponentLink5Description: Open Footprint 2; ComponentLink6Description: Open Footprint 3; ComponentLink7Description: Open Footprint 4; Operating Temperature: -55C to +155C; Category: Resistor; Type: RES SMD; Composition: TKF; Supplier 1: Digi-Key; Supplier Part Number 1: 311-0.0JRCT-ND; Quantity Override: 1; ComponentLink1URL: https://chn-vm-apps.microchip.com/mchprepo/parts/Datasheets/PYu-RC0402_51_RoHS_L_6.pdf; ComponentLink2URL: C:\ALTIUM_WORK\00001_MCHP-CDB\Datasheets\PYu-RC0402_51_RoHS_L_6.pdf; Manufacturer 2: Stackpole Electronics Inc; Manufacturer Part Number 2: RMCF0402ZT0R00; Supplier 2: Digi-Key; Supplier Part Number 2: RMCF0402ZT0R00TR-ND
R185 = RSMT1040: Manufacturer 1: Yageo; Manufacturer Part Number 1: RC0402JR-070RL; Description_: RES TKF 0R 1/16W SMD 0402; Dev Tools Status: Production; Power: 1/16W; Owner: Sompoch Loboonlert; Populated: Yes; MCHP-ID: RSMT1040; Revision: 3; Symbol: Resistor; Status: MCL Design; ComponentLink1Description: SVN Datasheet; ComponentLink2Description: Local Datasheet; ComponentLink3URL: C:\ALTIUM_WORK\00001_MCHP-CDB\Library\LibraryRefs\Resistor.SchLib; ComponentLink3Description: Open Symbol; ComponentLink4URL: C:\ALTIUM_WORK\00001_MCHP-CDB\Library\Footprints\RES_C_0402.PcbLib; ComponentLink4Description: Open Footprint; ComponentLink5Description: Open Footprint 2; ComponentLink6Description: Open Footprint 3; ComponentLink7Description: Open Footprint 4; Operating Temperature: -55C to +155C; Category: Resistor; Type: RES SMD; Composition: TKF; Supplier 1: Digi-Key; Supplier Part Number 1: 311-0.0JRCT-ND; Quantity Override: 1; ComponentLink1URL: https://chn-vm-apps.microchip.com/mchprepo/parts/Datasheets/PYu-RC0402_51_RoHS_L_6.pdf; ComponentLink2URL: C:\ALTIUM_WORK\00001_MCHP-CDB\Datasheets\PYu-RC0402_51_RoHS_L_6.pdf; Manufacturer 2: Stackpole Electronics Inc; Manufacturer Part Number 2: RMCF0402ZT0R00; Supplier 2: Digi-Key; Supplier Part Number 2: RMCF0402ZT0R00TR-ND
R186-R189 = RES1022: Manufacturer 1: Panasonic; Manufacturer Part Number 1: ERJ-2RKF1001X; Description_: RES TKF 1k 1% 1/10W SMD 0402; Dev Tools Status: Production; Voltage: 50V; Power: 1/10W; Owner: Tad Ahlvers; Populated: YES; Temperature Coefficient: 100ppm/C; MCHP-ID: RES1022; Revision: 3; Symbol: Resistor; Status: MCL Design; ComponentLink1URL: https://chn-vm-apps.microchip.com/mchprepo/parts/Datasheets/AOA0000CE2.pdf; ComponentLink1Description: SVN Datasheet; ComponentLink2URL: C:\ALTIUM_WORK\00001_MCHP-CDB\Datasheets\AOA0000CE2.pdf; ComponentLink2Description: Local Datasheet; ComponentLink3URL: C:\ALTIUM_WORK\00001_MCHP-CDB\Library\LibraryRefs\Resistor.SchLib; ComponentLink3Description: Open Symbol; ComponentLink4URL: C:\ALTIUM_WORK\00001_MCHP-CDB\Library\Footprints\RES_C_0402.PcbLib; ComponentLink4Description: Open Footprint; ComponentLink5Description: Open Footprint 2; ComponentLink6Description: Open Footprint 3; ComponentLink7Description: Open Footprint 4; Operating Temperature: -55C to +155C; Category: Resistor; Type: RES SMD; Composition: TKF; Supplier 1: Digi-Key; Supplier Part Number 1: P1.00KLTR-ND; Quantity Override: 1
R190 = RES2380: Manufacturer 1: Panasonic Electronic Components; Manufacturer Part Number 1: ERJ-2RKF6041X; Description_: RES TKF 6.04k 1% 1/10W SMD 0402 AEC-Q200; Dev Tools Status: Production; Power: 1/10W; Owner: Steve Dziaba; Populated: YES; Circuit Type: Isolated; Restricted Sourcing: No; MCHP-ID: RES2380; Revision: 1; Symbol: Resistor; Status: MCL Design; ComponentLink1Description: SVN Datasheet; ComponentLink2Description: Local Datasheet; ComponentLink3URL: C:\ALTIUM_WORK\00001_MCHP-CDB\Library\LibraryRefs\Resistor.SchLib; ComponentLink3Description: Open Symbol; ComponentLink4URL: C:\ALTIUM_WORK\00001_MCHP-CDB\Library\Footprints\RES_C_0402.PcbLib; ComponentLink4Description: Open Footprint; ComponentLink5Description: Open Footprint 2; ComponentLink6Description: Open Footprint 3; ComponentLink7Description: Open Footprint 4; Category: Resistor; Type: RES SMD; Composition: TKF; Supplier 1: Digi-Key; Supplier Part Number 1: P6.04KLCT-ND; Quantity Override: 1; ComponentLink1URL: https://chn-vm-apps.microchip.com/mchprepo/parts/Datasheets/ERJ-2RKF6041X.pdf; ComponentLink2URL: C:\ALTIUM_WORK\00001_MCHP-CDB\Datasheets\ERJ-2RKF6041X.pdf; Manufacturer 2: KOA Speer; Manufacturer Part Number 2: RK73H1ETTP6041F; Supplier 2: Digi-Key; Supplier Part Number 2: 2019-RK73H1ETTP6041FCT-ND
R191-R193 = RES1022: Manufacturer 1: Panasonic; Manufacturer Part Number 1: ERJ-2RKF1001X; Description_: RES TKF 1k 1% 1/10W SMD 0402; Dev Tools Status: Production; Voltage: 50V; Power: 1/10W; Owner: Tad Ahlvers; Temperature Coefficient: 100ppm/C; MCHP-ID: RES1022; Revision: 3; Symbol: Resistor; Status: MCL Design; ComponentLink1URL: https://chn-vm-apps.microchip.com/mchprepo/parts/Datasheets/AOA0000CE2.pdf; ComponentLink1Description: SVN Datasheet; ComponentLink2URL: C:\ALTIUM_WORK\00001_MCHP-CDB\Datasheets\AOA0000CE2.pdf; ComponentLink2Description: Local Datasheet; ComponentLink3URL: C:\ALTIUM_WORK\00001_MCHP-CDB\Library\LibraryRefs\Resistor.SchLib; ComponentLink3Description: Open Symbol; ComponentLink4URL: C:\ALTIUM_WORK\00001_MCHP-CDB\Library\Footprints\RES_C_0402.PcbLib; ComponentLink4Description: Open Footprint; ComponentLink5Description: Open Footprint 2; ComponentLink6Description: Open Footprint 3; ComponentLink7Description: Open Footprint 4; Operating Temperature: -55C to +155C; Category: Resistor; Type: RES SMD; Composition: TKF; Supplier 1: Digi-Key; Supplier Part Number 1: P1.00KLTR-ND; Quantity Override: 1
TP6-TP8 = CON1759: Test Point; Value: TP PAD PCB 1mm; Description_: CON TP PAD PCB 1mm SMD; Dev Tools Status: Design; Owner: Cristian Papuc; Populated: YES; MCHP-ID: CON1759; Revision: A; Symbol: Test Point No BOM; Status: MCL Design; ComponentLink1Description: SVN Datasheet; ComponentLink2Description: Local Datasheet; ComponentLink3URL: C:\ALTIUM_WORK\00001_MCHP-CDB\Library\LibraryRefs\Test Point No BOM.SchLib; ComponentLink3Description: Open Symbol; ComponentLink4URL: C:\ALTIUM_WORK\00001_MCHP-CDB\Library\Footprints\TP_1mm_SMD.PcbLib; ComponentLink4Description: Open Footprint; ComponentLink5Description: Open Footprint 2; ComponentLink6Description: Open Footprint 3; ComponentLink7Description: Open Footprint 4; Type: Test Point; Category: Connector; Quantity Override: 1
U13 = MIC6967: Manufacturer 1: Microchip Technology; Manufacturer Part Number 1: MIC33153YHJ-TR; Description_: MCHP ANALOG SWITCHER Buck 0.6V to 3.6V MIC33153YHJ-TR VFDFN-14; Dev Tools Status: Production; Owner: Razvan Cristescu; Populated: YES; MCHP-ID: MIC6967; Symbol: MIC33153 VFDFN-14; Type: Switcher; Status: MCL Design; Revision: 2; Category: MCHP-Analog; ComponentLink1URL: https://chn-vm-apps.microchip.com/mchprepo/parts/Datasheets/mic33153.pdf; ComponentLink1Description: SVN Datasheet; ComponentLink2URL: C:\ALTIUM_WORK\00001_MCHP-CDB\Datasheets\mic33153.pdf; ComponentLink2Description: Local Datasheet; ComponentLink3URL: C:\ALTIUM_WORK\00001_MCHP-CDB\Library\LibraryRefs\MIC33153 VFDFN-14.SchLib; ComponentLink3Description: Open Symbol; ComponentLink4URL: C:\ALTIUM_WORK\00001_MCHP-CDB\Library\Footprints\VFDFN-14_3X3.5_MIC33153.PcbLib; ComponentLink4Description: Open Footprint; ComponentLink5Description: Open Footprint 2; ComponentLink6Description: Open Footprint 3; ComponentLink7Description: Open Footprint 4; Supplier 1: Digi-Key; Supplier Part Number 1: 576-3904-1-ND; Operating Temperature: -40C to +125C; Quantity Override: 1
U14 = MIC9755: Manufacturer 1: Microchip Technology; Description_: MCHP INTERFACE ETHERNET LAN8840 QFN-48; Dev Tools Status: Design; Owner: Sam Charles; Populated: YES; MCHP-ID: MIC9755; Symbol: LAN8840_QFN-48; Type: Ethernet; Status: MCL Design; Revision: 1; Category: MCHP-Interface; ComponentLink1URL: https://www.microchip.com/sitesearch/search/Product%20and%20Development%20Tools/LAN8840-V/PSA; ComponentLink1Description: SVN Datasheet; ComponentLink2Description: Local Datasheet; ComponentLink3URL: C:\ALTIUM_WORK\00001_MCHP-CDB\Library\LibraryRefs\LAN8840_QFN-48.SchLib; ComponentLink3Description: Open Symbol; ComponentLink4URL: C:\ALTIUM_WORK\00001_MCHP-CDB\Library\Footprints\QFN-48_7x7_EP5.1x5.1.PcbLib; ComponentLink4Description: Open Footprint; ComponentLink5Description: Open Footprint 2; ComponentLink6Description: Open Footprint 3; ComponentLink7Description: Open Footprint 4; Manufacturer Part Number 1: LAN8840-V/PSA; Supplier 1: Microchip Technology; Supplier Part Number 1: LAN8840-V/PSA; Quantity Override: 1; Operating Temperature: -40°C ~ 105°C
Y5 = OSC1302: Manufacturer 1: ECS Inc.; Description_: CRYSTAL 25MHz 10pF SMD L2W1.6H0.5; Dev Tools Status: Design; Owner: Ciprian Abramov; Tolerance: 10ppm; Populated: YES; MCHP-ID: OSC1302; Revision: 1; Symbol: Crystal 4 Pins; Status: MCL Design; ComponentLink1Description: SVN Datasheet; ComponentLink2Description: Local Datasheet; ComponentLink3URL: C:\ALTIUM_WORK\00001_MCHP-CDB\Library\LibraryRefs\Crystal 4 Pins.SchLib; ComponentLink3Description: Open Symbol; ComponentLink4URL: C:\ALTIUM_WORK\00001_MCHP-CDB\Library\Footprints\CRYSTAL_L2.0W1.6H0.5_FA-128.PcbLib; ComponentLink4Description: Open Footprint; ComponentLink5Description: Open Footprint 2; ComponentLink6Description: Open Footprint 3; ComponentLink7Description: Open Footprint 4; Operating Temperature: -40C to +85C; Package: L2.0W1.6H0.5; Type: Crystal; Category: Crystal/Oscillator; Supplier 1: Digi-Key; Supplier Part Number 1: XC3065TR-ND; Quantity Override: 1